# Altium project PCB_Project_UWB.PrjPcb
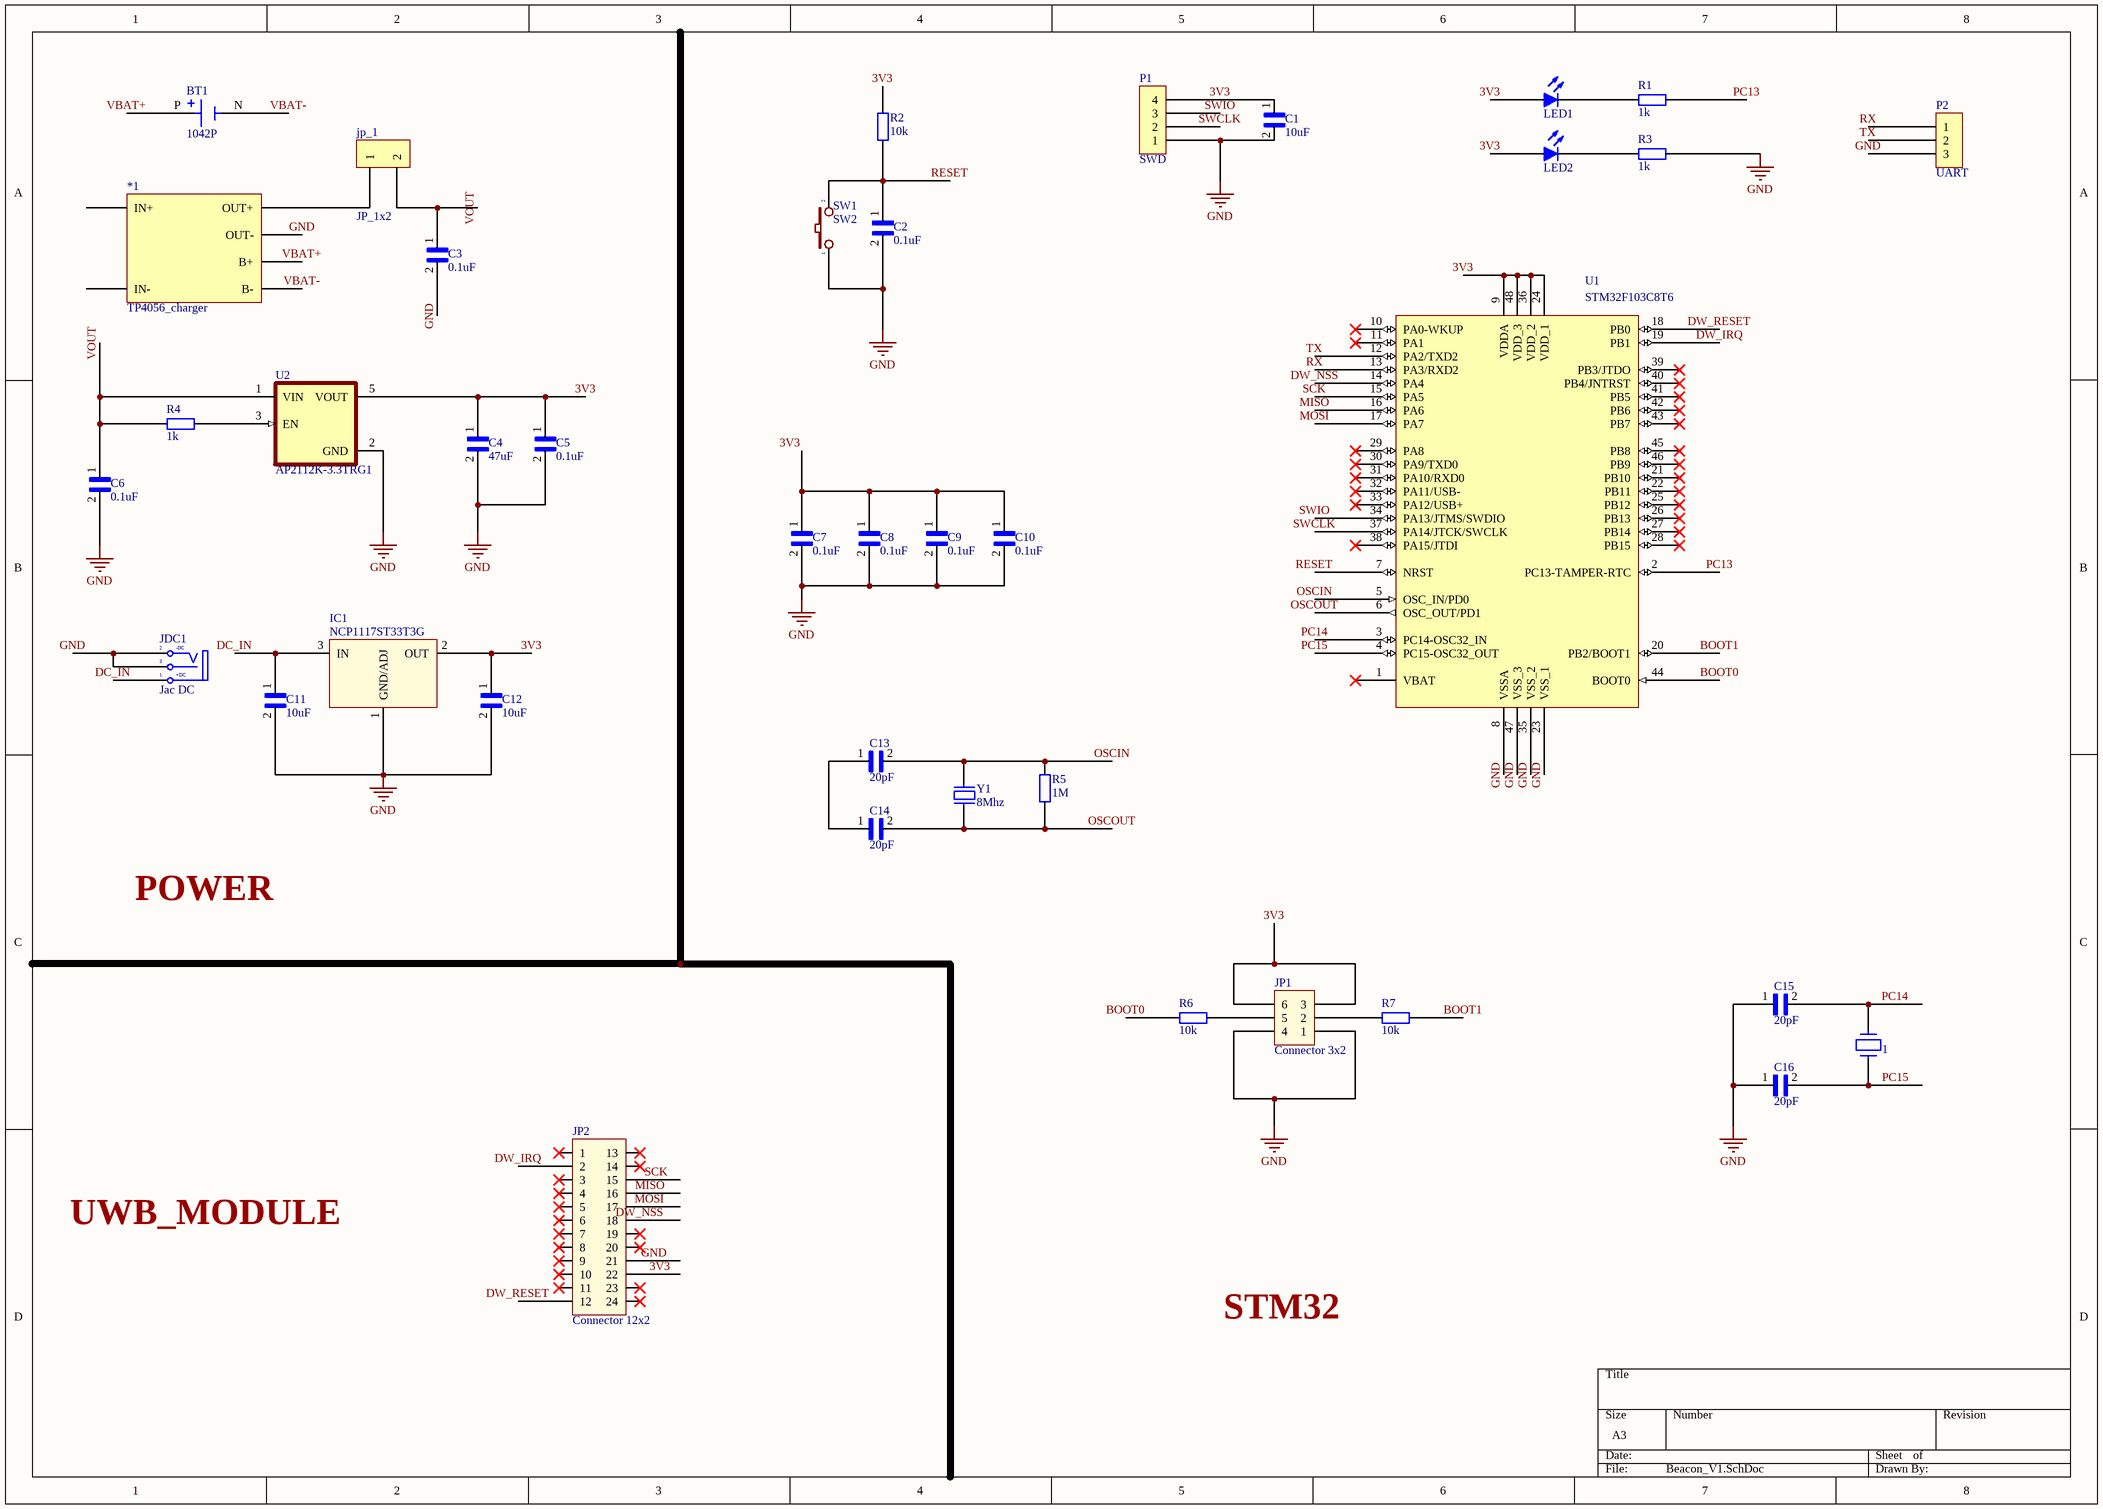
[diagram p0: Beacon_V1.SchDoc]
1 sheet, 39 parts. Net scope: global (net labels, ports and power ports of the same name join across sheets).
Board file: Beacon_V1.PcbDoc

## Sheet Beacon_V1.SchDoc
size A3; SheetNumber: 1; SheetTotal: 1

### Parts
1  ABS07  [ABS07]  (value not drawn)
*1  TP4056_charger  [TP4056_charger]
BT1  1042P  [BAT_1042P]
C1  10uF  [Capacitor_0805]
C2  0.1uF  [Capacitor_0805]
C3  0.1uF  [Capacitor_0805]
C4  47uF  [Capacitor_0805]
C5  0.1uF  [Capacitor_0805]
C6  0.1uF  [Capacitor_0805]
C7  0.1uF  [Capacitor_0805]
C8  0.1uF  [Capacitor_0805]
C9  0.1uF  [Capacitor_0805]
C10  0.1uF  [Capacitor_0805]
C11  10uF  [Capacitor_0805]
C12  10uF  [Capacitor_0805]
C13  20pF  [Capacitor_0805]
C14  20pF  [Capacitor_0805]
C15  20pF  [Capacitor_0805]
C16  20pF  [Capacitor_0805]
IC1  NCP1117ST33T3G  [SOT223-3_ONS]
JDC1  Jac DC  [DC-IN]
JP1  Connector 3x2  [JP3x2]
JP2  Connector 12x2  [JP12X2_1]
jp_1  JP_1x2  [JP_1x2]
LED1  Led  [Led 0805 Blue]  (value not drawn)
LED2  Led  [Led 0805 Blue]  (value not drawn)
P1  SWD  [HDR/Header/4/BOX]
P2  UART  [HDR/Header/3/BOX]
R1  1k  [tro smd 0805]
R2  10k  [tro smd 0805]
R3  1k  [tro smd 0805]
R4  1k  [tro smd 0805]
R5  1M  [tro smd 0805]
R6  10k  [tro smd 0805]
R7  10k  [tro smd 0805]
SW1  SW2  [SW1-SMD]
U1  STM32F103C8T6  [LQFP48]
U2  AP2112K-3.3TRG1  [SOT95P285X140-5N]
Y1  8Mhz  [Thach Anh 2 chan SMD5032]

### Nets
GND: *1.4(OUT-) C1.2 C2.2 C3.2 C4.2 C5.2 C6.2 C7.2 C8.2 C9.2 C10.2 C11.2 C12.2 C15.1 C16.1 IC1.1(GND/ADJ) JDC1.2(TN) JDC1.3(S) JP1.1 JP1.4 JP2.21 P1.1 P2.3 R3.2 SW1.1 U1.8(VSSA) U1.23(VSS_1) U1.35(VSS_2) U1.47(VSS_3) U2.2(GND)
3V3: C1.1 C4.1 C5.1 C7.1 C8.1 C9.1 C10.1 C12.1 IC1.2(OUT) JP1.3 JP1.6 JP2.22 LED1.1(A) LED2.1(A) P1.4 R2.2 U1.9(VDDA) U1.24(VDD_1) U1.36(VDD_2) U1.48(VDD_3) U2.5(VOUT)
BOOT0: R6.1 U1.44(BOOT0)
BOOT1: R7.2 U1.20(PB2/BOOT1)
DC_IN: C11.1 IC1.3(IN) JDC1.1(T)
DW_IRQ: JP2.2 U1.19(PB1)
DW_NSS: JP2.18 U1.14(PA4)
DW_RESET: JP2.12 U1.18(PB0)
MISO: JP2.16 U1.16(PA6)
MOSI: JP2.17 U1.17(PA7)
OSCIN: C13.2 R5.2 U1.5(OSC_IN/PD0) Y1.2
OSCOUT: C14.2 R5.1 U1.6(OSC_OUT/PD1) Y1.1
PC13: R1.2 U1.2(PC13-TAMPER-RTC)
PC14: 1.2 C15.2 U1.3(PC14-OSC32_IN)
PC15: 1.1 C16.2 U1.4(PC15-OSC32_OUT)
RESET: C2.1 R2.1 SW1.2 U1.7(NRST)
RX: P2.1 U1.13(PA3/RXD2)
SCK: JP2.15 U1.15(PA5)
SWCLK: P1.2 U1.37(PA14/JTCK/SWCLK)
SWIO: P1.3 U1.34(PA13/JTMS/SWDIO)
TX: P2.2 U1.12(PA2/TXD2)
VBAT+: *1.1(B+) BT1.P(POS)
VBAT-: *1.2(B-) BT1.N(NEG)
VOUT: C3.1 C6.1 jp_1.2 R4.1 U2.1(VIN)
Net*1_3: *1.3(OUT+) jp_1.1
NetC13_1: C13.1 C14.1
NetJP1_2: JP1.2 R7.1
NetJP1_5: JP1.5 R6.2
NetLED1_2: LED1.2(K) R1.1
NetLED2_2: LED2.2(K) R3.1
NetR4_2: R4.2 U2.3(EN)

Not connected (* = marked no-connect by the designer): *1 5(IN+) 6(IN-); JP2 1* 3* 4* 5* 6* 7* 8* 9* 10* 11* 13* 14* 19* 20* 23* 24*; U1 1(VBAT)* 10(PA0-WKUP)* 11(PA1)* 21(PB10)* 22(PB11)* 25(PB12)* 26(PB13)* 27(PB14)* 28(PB15)* 29(PA8)* 30(PA9/TXD0)* 31(PA10/RXD0)* 32(PA11/USB-)* 33(PA12/USB+)* 38(PA15/JTDI)* 39(PB3/JTDO)* 40(PB4/JNTRST)* 41(PB5)* 42(PB6)* 43(PB7)* 45(PB8)* 46(PB9)*

### Notes on the sheet
- POWER
- UWB_MODULE
- STM32
- (in symbol DCIN) -DC; +DC

### Library data of the parts
1 = ABS07: SMD Quartz Crystal; Created By: Zion Blue; Published: 28 April 2014; Publisher: Cynetik Group
BT1 = 1042P: SMT Polarized Battery Holder for 18650 Battery | Keystone Electronics 1042P; SnapEDA_Link: https://www.snapeda.com/parts/1042P/Keystone/view-part/?ref=snap; Package: None; Value: *; MF: Keystone Electronics; MP: 1042P; Check_prices: https://www.snapeda.com/parts/1042P/Keystone/view-part/?ref=eda
C1-C16 = Capacitor_0805: Capacitor; Ceramic; Cap; .220uF; Tol 10%; SMT; Vol-Rtg 50V; X7R; Tape And Reel
IC1 = NCP1117ST33T3G: SOT223
JDC1 = DCIN: Jac DC input; Value: Jac DC
JP1 = JP3x2: Value: Connector 3x2
JP2 = JP12x2: Value: Connector 12x2
LED1 LED2 = Led: Typical LED
P1 = Header 4_1: Header, 4-Pin
P2 = Header 3: Header, 3-Pin
R1 R3 R4 = Tro 0805 1% 1k: Dán; Don_Vi: Con; So_Chan: 2; Ten_Linh_Kien: Trở 0805 1% 1k; Ma_Hang: MH005468; Chung_Loai: Dán; Kieu_Chan: *
R2 R6 R7 = Tro 0805 1% 10k: Dán; Don_Vi: Con; So_Chan: 2; Ten_Linh_Kien: Trở 0805 1% 10k; Ma_Hang: MH005473; Chung_Loai: Dán; Kieu_Chan: *
R5 = Tro 0805 1% 1M: Dán; Don_Vi: Con; So_Chan: 2; Ten_Linh_Kien: Trở 0805 1% 1M; Ma_Hang: MH005469; Chung_Loai: Dán; Kieu_Chan: *
SW1 = SW2: Switch button 2 pin; Value: SW chip 2 pin
U1 = STM32F103C8T6: STM32 ARM-based 32-bit MCU with ARM 32-bit Cortex-M3 Microcontroller, 128 Kbytes Flash, 48-pin LQFP, Industrial Temperature; Published: 30-May-2008; DatasheetVersion: rev6, Mar-2008; PackageVersion: Mar-2008; PackageReference: LQFP48; Publisher: Altium Limited; PackageDescription: 48-Pin Low-Profile Quad Flat Pack, 7 x 7 mm Body, 0.5 mm Pitch (LQFP48); ComponentLink1Description: Manufacturer Link; ComponentLink1URL: www.st.com/stm32; ComponentLink2Description: Datasheet; ComponentLink2URL: http://www.st.com/stonline/products/literature/ds/13586.pdf
U2 = AP2112K-3.3TRG1: Linear Voltage Regulator IC Positive Fixed 1 Output 600mA SOT-25; MF: Diodes Inc.; Value: *; Purchase-URL: https://pricing.snapeda.com/search/part/AP2112K-3.3TRG1/?ref=eda; Package: SOT-753 Diodes Inc.; Availability: In Stock; Check_prices: https://www.snapeda.com/parts/AP2112K-3.3TRG1/Diodes+Inc./view-part/?ref=eda; Price: None; SnapEDA_Link: https://www.snapeda.com/parts/AP2112K-3.3TRG1/Diodes+Inc./view-part/?ref=snap; MP: AP2112K-3.3TRG1
Y1 = Thach Anh 2 chan SMD 5032: Crystal For all Crystal 2pin.; Value: 4Mhz